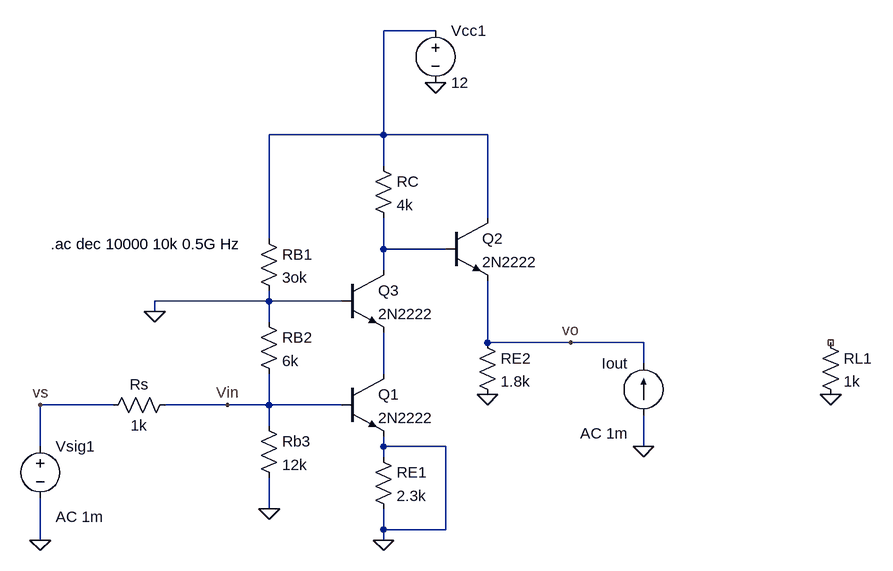
[diagram p0: schematic aks5.asc]
aks5.asc, the LTspice schematic file:
Version 4
SHEET 1 1044 680
WIRE 272 -272 192 -272
WIRE 192 -112 192 -272
WIRE 192 -112 16 -112
WIRE 352 -112 192 -112
WIRE 192 -64 192 -112
WIRE 352 16 352 -112
WIRE 16 48 16 -112
WIRE 192 64 192 16
WIRE 288 64 192 64
WIRE 192 96 192 64
WIRE 16 144 16 128
WIRE 16 144 -160 144
WIRE 128 144 16 144
WIRE -160 160 -160 144
WIRE 16 176 16 144
WIRE 352 208 352 112
WIRE 480 208 352 208
WIRE 592 208 480 208
WIRE 592 240 592 208
WIRE 192 256 192 192
WIRE -224 304 -336 304
WIRE -48 304 -144 304
WIRE 16 304 16 256
WIRE 16 304 -48 304
WIRE 128 304 16 304
WIRE 16 336 16 304
WIRE -336 368 -336 304
WIRE 192 368 192 352
WIRE 288 368 192 368
WIRE 592 368 592 320
WIRE 192 384 192 368
WIRE 16 464 16 416
WIRE 192 496 192 464
WIRE 288 496 288 368
WIRE 288 496 192 496
WIRE -336 512 -336 448
WIRE 192 512 192 496
FLAG 16 464 0
FLAG -160 160 0
FLAG 192 512 0
FLAG 352 288 0
FLAG 880 288 0
FLAG 272 -192 0
FLAG -336 512 0
FLAG 480 208 vo
FLAG -336 304 vs
FLAG -48 304 Vin
FLAG 592 368 0
SYMBOL res -128 288 R90
WINDOW 0 0 56 VBottom 2
WINDOW 3 32 56 VTop 2
SYMATTR InstName Rs
SYMATTR Value 1k
SYMBOL res 0 320 R0
SYMATTR InstName Rb3
SYMATTR Value 12k
SYMBOL res 0 160 R0
SYMATTR InstName RB2
SYMATTR Value 6k
SYMBOL res 0 32 R0
SYMATTR InstName RB1
SYMATTR Value 3ok
SYMBOL npn 128 256 R0
SYMATTR InstName Q1
SYMATTR Value 2N2222
SYMBOL res 176 368 R0
SYMATTR InstName RE1
SYMATTR Value 2.3k
SYMBOL res 176 -80 R0
SYMATTR InstName RC
SYMATTR Value 4k
SYMBOL npn 288 16 R0
SYMATTR InstName Q2
SYMATTR Value 2N2222
SYMBOL res 336 192 R0
SYMATTR InstName RE2
SYMATTR Value 1.8k
SYMBOL res 864 192 R0
SYMATTR InstName RL1
SYMATTR Value 1k
SYMBOL voltage 272 -288 R0
SYMATTR InstName Vcc1
SYMATTR Value 12
SYMBOL voltage -336 352 R0
WINDOW 3 24 96 Invisible 2
WINDOW 123 24 124 Left 2
WINDOW 39 0 0 Left 0
SYMATTR Value 0
SYMATTR Value2 AC 1m
SYMATTR InstName Vsig1
SYMBOL npn 128 96 R0
SYMATTR InstName Q3
SYMATTR Value 2N2222
SYMBOL current 592 320 R180
WINDOW 0 24 80 Left 2
WINDOW 3 24 0 Invisible 2
WINDOW 123 24 -28 Left 2
WINDOW 39 0 0 Left 0
SYMATTR InstName Iout
SYMATTR Value 0
SYMATTR Value2 AC 1m
TEXT -320 56 Left 2 !.ac dec 10000 10k 0.5G Hz

The netlist it stands for:
* aks5.asc
Rs Vin vs 1k
Rb3 Vin 0 12k
RB2 0 Vin 6k
RB1 N001 0 3ok
Q1 N003 Vin 0 0 2N2222
RE1 0 0 2.3k
RC N001 N002 4k
Q2 N001 N002 vo 0 2N2222
RE2 vo 0 1.8k
RL1 NC_01 0 1k
Vcc1 N001 0 12
Vsig1 vs 0 0 AC 1m
Q3 N002 0 N003 0 2N2222
Iout 0 vo 0 AC 1m
.model NPN NPN
.model PNP PNP
.lib standard.bjt
.ac dec 10000 10k 0.5G Hz
.backanno
.end